# EAGLE schematic MainBoard_new (EAGLE 6.3)
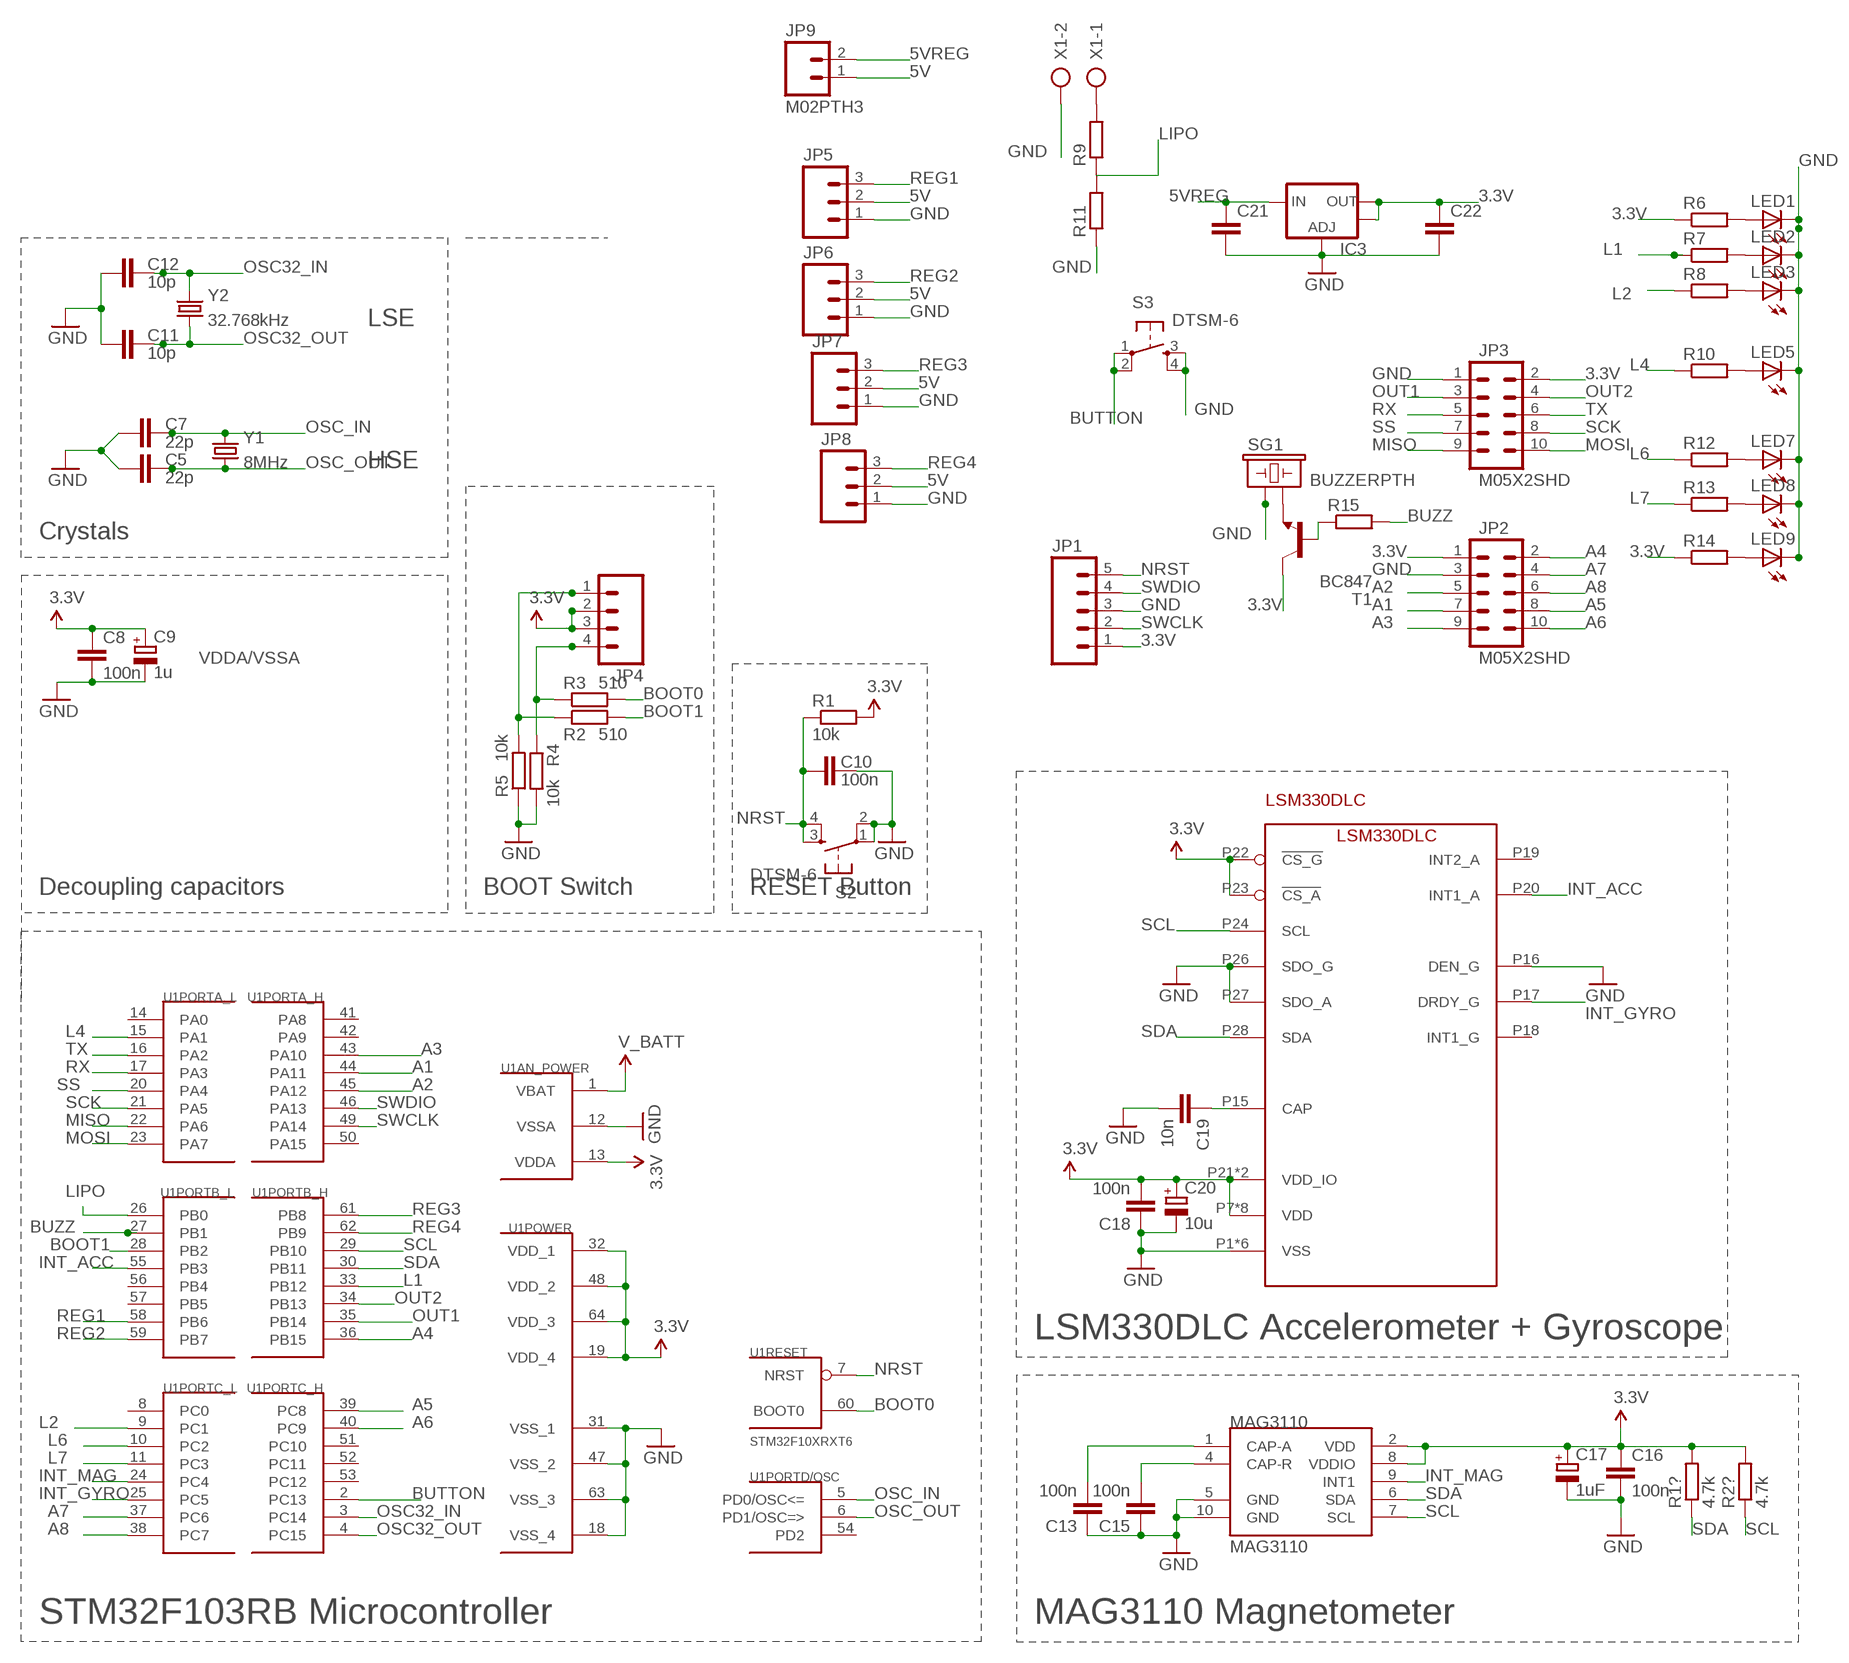
[diagram p0: schematic, sheet 1]

## Parts
C5  22p  C-EUC0805  [C0805]
C7  22p  C-EUC0805  [C0805]
C8  100n  C-EUC0805  [C0805]
C9  1u  CPOL-EUSMCA  [SMC_A]
C10  100n  C-EUC0805  [C0805]
C11  10p  C-EUC0805  [C0805]
C12  10p  C-EUC0805  [C0805]
C13  100n  C-EUC0805  [C0805]
C15  100n  C-EUC0805  [C0805]
C16  100n  C-EUC0805  [C0805]
C17  1uF  CPOL-EUSMCA  [SMC_A]
C18  100n  C-EUC0805  [C0805]
C19  10n  C-EUC0805  [C0805]
C20  10u  CPOL-EUSMCA  [SMC_A]
C21  C-EUC0805  [C0805]
C22  C-EUC0805  [C0805]
IC3  V_REG_LM1117SOT223  [SOT223]
JP1  M05PTH_LONGPADS  [1X05_LONGPADS]
JP2  M05X2SHD  [2X5-SHROUDED]
JP3  M05X2SHD  [2X5-SHROUDED]
JP4  M04LONGPADS  [1X04_LONGPADS]
JP5  M03LONGPADS  [1X03_LONGPADS]
JP6  M03LONGPADS  [1X03_LONGPADS]
JP7  M03LONGPADS  [1X03_LONGPADS]
JP8  M03LONGPADS  [1X03_LONGPADS]
JP9  M02PTH3  [1X02_LONGPADS]
LED1  LEDCHIPLED_0805  [CHIPLED_0805]
LED2  LEDCHIPLED_0805  [CHIPLED_0805]
LED3  LEDCHIPLED_0805  [CHIPLED_0805]
LED5  LEDCHIPLED_0805  [CHIPLED_0805]
LED7  LEDCHIPLED_0805  [CHIPLED_0805]
LED8  LEDCHIPLED_0805  [CHIPLED_0805]
LED9  LEDCHIPLED_0805  [CHIPLED_0805]
LSM330DLC  LSM330DLC  [LGA_4X5X1P1_28L]
MAG3110  MAG3110  [DFN-10]
R1  10k  R-EU_R0805  [R0805]
R1?  4.7k  R-EU_R0805  [R0805]
R2  510  R-EU_R0805  [R0805]
R2?  4.7k  R-EU_R0805  [R0805]
R3  510  R-EU_R0805  [R0805]
R4  10k  R-EU_R0805  [R0805]
R5  10k  R-EU_R0805  [R0805]
R6  R-EU_M0805  [M0805]
R7  R-EU_M0805  [M0805]
R8  R-EU_M0805  [M0805]
R9  R-EU_M0805  [M0805]
R10  R-EU_M0805  [M0805]
R11  R-EU_M0805  [M0805]
R12  R-EU_M0805  [M0805]
R13  R-EU_M0805  [M0805]
R14  R-EU_M0805  [M0805]
R15  R-EU_R0805  [R0805]
S2  DTSM-6  [DTSM-6]
S3  DTSM-6  [DTSM-6]
SG1  BUZZERPTH  [BUZZER-12MM]
T1  BC847  [SOT23]
U1  STM32F10XRXT6  [TQFP64]
X1  AK300/2  [AK300/2]
Y1  8MHz  CRYSTALSMD  [HC49UP]
Y2  32.768kHz  CRYSTALEPSONMC146  [CRYSTAL-32KHZ-SMD_EPSON_MC146]

## Nets
3.3V: C8.1 C9.+ C16.1 C17.+ C18.2 C20.+ C22.1 IC3.2(OUT) IC3.4(OUT) JP1.1 JP2.1 JP3.2 JP4.2 JP4.3 LSM330DLC.P7(VDD) LSM330DLC.P8(VDD) LSM330DLC.P9(VDD) LSM330DLC.P10(VDD) LSM330DLC.P11(VDD) LSM330DLC.P12(VDD) LSM330DLC.P13(VDD) LSM330DLC.P14(VDD) LSM330DLC.P21(VDD_IO) LSM330DLC.P22(!CS_G) LSM330DLC.P23(!CS_A) LSM330DLC.P25(VDD_IO) MAG3110.2(VDD) MAG3110.8(VDDIO) R1.2 R1?.2 R2?.2 R6.1 R14.1 T1.3(C) U1.13(AN_POWER:VDDA) U1.19(POWER:VDD_4) U1.32(POWER:VDD_1) U1.48(POWER:VDD_2) U1.64(POWER:VDD_3)
5V: JP5.2 JP6.2 JP7.2 JP8.2 JP9.1
5VREG: C21.1 IC3.3(IN) JP9.2
A1: JP2.7 U1.44(PORTA_H:PA11)
A2: JP2.5 U1.45(PORTA_H:PA12)
A3: JP2.9 U1.43(PORTA_H:PA10)
A4: JP2.2 U1.36(PORTB_H:PB15)
A5: JP2.8 U1.39(PORTC_H:PC8)
A6: JP2.10 U1.40(PORTC_H:PC9)
A7: JP2.4 U1.37(PORTC_L:PC6)
A8: JP2.6 U1.38(PORTC_L:PC7)
BOOT0: R3.2 U1.60(RESET:BOOT0)
BOOT1: R2.2 U1.28(PORTB_L:PB2)
BUTTON: S3.1 S3.2 U1.2(PORTC_H:PC13)
BUZZ: R15.2 U1.27(PORTB_L:PB1)
GND: C5.1 C7.1 C8.2 C9.- C10.2 C11.1 C12.1 C13.1 C15.1 C16.2 C17.- C18.1 C19.2 C20.- C21.2 C22.2 IC3.1(ADJ) JP1.3 JP2.3 JP3.1 JP5.1 JP6.1 JP7.1 JP8.1 LED1.C LED2.C LED3.C LED5.C LED7.C LED8.C LED9.C LSM330DLC.P1(VSS) LSM330DLC.P2(VSS) LSM330DLC.P3(VSS) LSM330DLC.P4(VSS) LSM330DLC.P5(VSS) LSM330DLC.P6(VSS) LSM330DLC.P16(DEN_G) LSM330DLC.P26(SDO_G) LSM330DLC.P27(SDO_A) MAG3110.5(GND) MAG3110.10(GND) R4.2 R5.1 R11.1 S2.1 S2.2 S3.3 S3.4 SG1.+ U1.12(AN_POWER:VSSA) U1.18(POWER:VSS_4) U1.31(POWER:VSS_1) U1.47(POWER:VSS_2) U1.63(POWER:VSS_3) X1.2
INT_ACC: LSM330DLC.P20(INT1_A) U1.55(PORTB_L:PB3)
INT_GYRO: LSM330DLC.P17(DRDY_G) U1.25(PORTC_L:PC5)
INT_MAG: MAG3110.9(INT1) U1.24(PORTC_L:PC4)
L1: R7.1 U1.33(PORTB_H:PB12)
L2: R8.1 U1.9(PORTC_L:PC1)
L4: R10.1 U1.15(PORTA_L:PA1)
L6: R12.1 U1.10(PORTC_L:PC2)
L7: R13.1 U1.11(PORTC_L:PC3)
LIPO: R9.1 R11.2 U1.26(PORTB_L:PB0)
MISO: JP3.9 U1.22(PORTA_L:PA6)
MOSI: JP3.10 U1.23(PORTA_L:PA7)
N$1: JP4.1 R2.1 R5.2
N$2: JP4.4 R3.1 R4.1
N$3: C15.2 MAG3110.4(CAP-R)
N$4: C13.2 MAG3110.1(CAP-A)
N$5: C19.1 LSM330DLC.P15(CAP)
N$6: LED1.A R6.2
N$7: LED2.A R7.2
N$8: LED3.A R8.2
N$10: LED5.A R10.2
N$12: LED7.A R12.2
N$13: LED8.A R13.2
N$14: LED9.A R14.2
N$17: SG1.- T1.2(E)
N$19: R9.2 X1.1
N$20: R15.1 T1.1(B)
NRST: C10.1 JP1.5 R1.1 S2.3 S2.4 U1.7(RESET:NRST)
OSC32_IN: C12.2 U1.3(PORTC_H:PC14) Y2.P$1
OSC32_OUT: C11.2 U1.4(PORTC_H:PC15) Y2.P$2
OSC_IN: C7.2 U1.5(PORTD/OSC:PD0/OSC<=) Y1.2
OSC_OUT: C5.2 U1.6(PORTD/OSC:PD1/OSC=>) Y1.1
OUT1: JP3.3 U1.35(PORTB_H:PB14)
OUT2: JP3.4 U1.34(PORTB_H:PB13)
REG1: JP5.3 U1.58(PORTB_L:PB6)
REG2: JP6.3 U1.59(PORTB_L:PB7)
REG3: JP7.3 U1.61(PORTB_H:PB8)
REG4: JP8.3 U1.62(PORTB_H:PB9)
RX: JP3.5 U1.17(PORTA_L:PA3)
SCK: JP3.8 U1.21(PORTA_L:PA5)
SCL: LSM330DLC.P24(SCL) MAG3110.7(SCL) R2?.1 U1.29(PORTB_H:PB10)
SDA: LSM330DLC.P28(SDA) MAG3110.6(SDA) R1?.1 U1.30(PORTB_H:PB11)
SS: JP3.7 U1.20(PORTA_L:PA4)
SWCLK: JP1.2 U1.49(PORTA_H:PA14)
SWDIO: JP1.4 U1.46(PORTA_H:PA13)
TX: JP3.6 U1.16(PORTA_L:PA2)
V_BATT: U1.1(AN_POWER:VBAT)
Unconnected: LSM330DLC.P18(INT1_G) LSM330DLC.P19(INT2_A) U1.8(PORTC_L:PC0) U1.14(PORTA_L:PA0) U1.41(PORTA_H:PA8) U1.42(PORTA_H:PA9) U1.50(PORTA_H:PA15) U1.51(PORTC_H:PC10) U1.52(PORTC_H:PC11) U1.53(PORTC_H:PC12) U1.54(PORTD/OSC:PD2) U1.56(PORTB_L:PB4) U1.57(PORTB_L:PB5)

## Notes on the sheet
- LSE
- HSE
- Crystals
- VDDA/VSSA
- Decoupling capacitors | BOOT Switch | RESET Button
- LSM330DLC Accelerometer + Gyroscope
- STM32F103RB Microcontroller | MAG3110 Magnetometer

## Library data of the parts
C5 C7 C8 C10-C13 C15 C16 C21 C22 = rcl:C-EU: CAPACITOR, European symbol
C9 C17 C20 = rcl:CPOL-EU: POLARIZED CAPACITOR, European symbol
C18 C19 = resistor:C-EU: CAPACITOR, European symbol
IC3 = SparkFun-PowerIC:V_REG_LM1117: Voltage Regulator LM1117 Standard adjustable voltage regulator but in SMD form. Spark Fun Electronics SKU : COM-00595
JP1 = SparkFun-Connectors:M05: Header 5 Standard 5-pin 0.1" header. Use with straight break away headers (SKU : PRT-00116), right angle break away headers (PRT-00553), swiss pins (PRT-00743), machine pins (PRT-00117), and female headers (PRT-00115). Molex polarized connector foot print use with SKU : PRT-08230 with associated crimp pins and housings.
JP2 JP3 = SparkFun-Connectors:M05X2: Header 5x2 Standard 10-pin dual row 0.1" header. Commonly used with AVR-ISP. Use with Spark Fun Electronics SKU: PRT-00778
JP4 = SparkFun-Connectors:M04: Header 4 Standard 4-pin 0.1" header. Use with straight break away headers (SKU : PRT-00116), right angle break away headers (PRT-00553), swiss pins (PRT-00743), machine pins (PRT-00117), and female headers (PRT-00115). Molex polarized connector foot print use with SKU : PRT-08231 with associated crimp pins and housings. 1MM SMD Version SKU: PRT-10208
JP5-JP8 = SparkFun-Connectors:M03: Header 3 Standard 3-pin 0.1" header. Use with straight break away headers (SKU : PRT-00116), right angle break away headers (PRT-00553), swiss pins (PRT-00743), machine pins (PRT-00117), and female headers (PRT-00115). Molex polarized connector foot print use with SKU : PRT-08232 with associated crimp pins and housings.
JP9 = SparkFun-Connectors:M02: Standard 2-pin 0.1" header. Use with - straight break away headers ( PRT-00116) - right angle break away headers (PRT-00553) - swiss pins (PRT-00743) - machine pins (PRT-00117) - female headers (PRT-00115) Molex polarized connector foot print use with: PRT-08233 with associated crimp pins and housings. 2.54_SCREWTERM for use with PRT-10571. 3.5mm Screw Terminal footprints for PRT-08084 5mm Screw Terminal footprints for use with PRT-08433
LED1-LED3 LED5 LED7-LED9 = led:LED: LED OSRAM: - CHIPLED LG R971, LG N971, LY N971, LG Q971, LY Q971, LO R971, LY R971 LH N974, LH R974 LS Q976, LO Q976, LY Q976 LO Q996 - Hyper CHIPLED LW Q18S LB Q993, LB Q99A, LB R99A - SideLED LS A670, LO A670, LY A670, LG A670, LP A670 LB A673, LV A673, LT A673, LW A673 LH A674 LY A675 LS A676, LA A676, LO A676, LY A676, LW A676 LS A679, LY A679, LG A679 - Hyper Micro SIDELED® LS Y876, LA Y876, LO Y876, LY Y876 LT Y87S - SmartLED LW L88C, LW L88S LB L89C, LB L89S, LG L890 LS L89K, LO L89K, LY L89K LS L896, LA L896, LO L896, LY L896 - TOPLED LS T670, LO T670, LY T670, LG T670, LP T670 LSG T670, LSP T670, LSY T670, LOP T670, LYG T670 LG T671, LOG T671, LSG T671 LB T673, LV T673, LT T673, LW T673 LH T674 LS T676, LA T676, LO T676, LY T676, LB T676, LH T676, LSB T676, LW T676 LB T67C, LV T67C, LT T67C, LS T67K, LO T67K, LY T67K, LW E67C LS E67B, LA E67B, LO E67B, LY E67B, LB E67C, LV E67C, LT E67C LW T67C LS T679, LY T679, LG T679 LS T770, LO T770, LY T770, LG T770, LP T770 LB T773, LV T773, LT T773, LW T773 LH T774 LS E675, LA E675, LY E675, LS T675 LS T776, LA T776, LO T776, LY T776, LB T776 LHGB T686 LT T68C, LB T68C - Hyper Mini TOPLED® LB M676 - Mini TOPLED Santana® LG M470 LS M47K, LO M47K, LY M47K Source: http://www.osram.convergy.de LUXEON: - LUMILED® LXK2-PW12-R00, LXK2-PW12-S00, LXK2-PW14-U00, LXK2-PW14-V00 LXK2-PM12-R00, LXK2-PM12-S00, LXK2-PM14-U00 LXK2-PE12-Q00, LXK2-PE12-R00, LXK2-PE12-S00, LXK2-PE14-T00, LXK2-PE14-U00 LXK2-PB12-K00, LXK2-PB12-L00, LXK2-PB12-M00, LXK2-PB14-N00, LXK2-PB14-P00, LXK2-PB14-Q00 LXK2-PR12-L00, LXK2-PR12-M00, LXK2-PR14-Q00, LXK2-PR14-R00 LXK2-PD12-Q00, LXK2-PD12-R00, LXK2-PD12-S00 LXK2-PH12-R00, LXK2-PH12-S00 LXK2-PL12-P00, LXK2-PL12-Q00, LXK2-PL12-R00 Source: www.luxeon.com KINGBRIGHT: KA-3528ASYC Source: www.kingbright.com
LSM330DLC = sensors-akc_zyr:LSM330DLC
MAG3110 = sparkfun-sensors (2):MAG3110: 3-axis digital (I2C) magnetometer
R1 R1? R2 R2? R3-R5 R15 = rcl:R-EU_: RESISTOR, European symbol
R6-R14 = resistor:R-EU_: RESISTOR, European symbol
S2 S3 = switch-tact:DTSM-6
SG1 = SparkFun-Electromechanical:BUZZER: Buzzer 12mm Spark Fun Electronics SKU : Comp-Buzzer
T1 = transistor:BC847: NPN TRANSISTOR
U1 = stm32:STM32F10XRXT6: STM32F101/103 64pin LQFP
X1 = con-ptr500:AK300/2: CONNECTOR; OC_FARNELL: unknown; OC_NEWARK: unknown
Y1 Y2 = SparkFun-FreqCtrl:CRYSTAL: Various standard crystals. Proven footprints. Spark Fun Electronics SKU : COM-00534